# Altium schematic sheet esquematicobluepill.SchDoc (part 2 of 3)
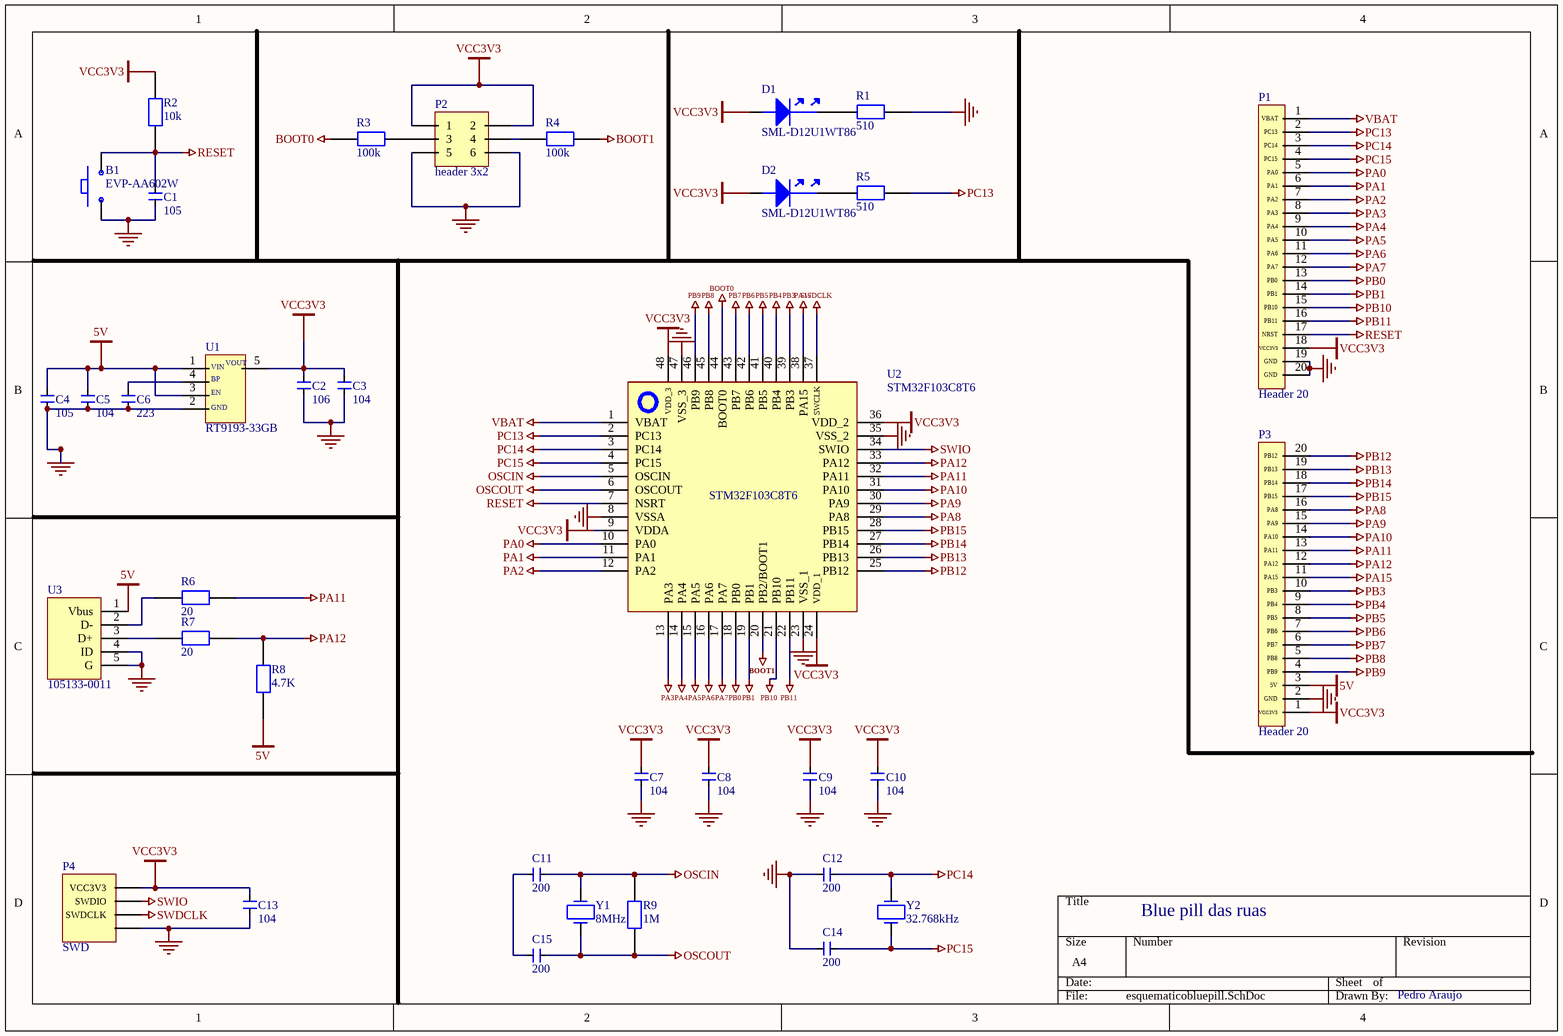
[diagram p1: esquematicobluepill.SchDoc]
## Library data of the parts
B1 = EVP-AA602W: Switch Tactile N.O. SPST Rectangular Button J-Bend 0.02A 15VDC 3.5N SMD Embossed T/R; Manufacturer: Panasonic; Actuator Length: 300µm; Contact Current Rating: 20mA; Contact Resistance: 100mΩ; Current Rating: 50mA; Electrical Life: 200kcycles; Illumination Type: Illuminated, Non-Illuminated; Max Voltage Rating (DC): 15V; Number of Positions: 1; Switch Function: Off-Mom; Switch Travel: 150µm; Supplier: DigiKey; Supplier Part Number: 10-EVP-AA602WCT-ND; Manufacturer Part Number: EVP-AA602W; RoHS: Compliant; Category: Tactile Switches; Stock: 14605; Pricing: 1=0,83, 10=0,713, 25=0,6632, 100=0,5917, 250=0,54812, 500=0,51772, 1000=0,48978, 2500=0,45678 (USD); Case/Package: SMD/SMT; Color: White; Contact Plating: Gold, Silver; Depth: 2.9mm; Height: 1.4mm; Insulation Resistance: 100MΩ; Lead Free: Lead Free; Length: 4.3mm; Lifecycle Status: Production; Max Current Rating: 20mA; Max Operating Temperature: 85°C; Mechanical Life: 200kcycles; Min Operating Temperature: -40°C; Mounting Technology: Surface Mount; Operating Force: 3.5N; Radiation Hardening: No; REACH SVHC: Yes; Termination: J-Bend; Throw Configuration: SPST; Voltage Rating (DC): 15V; ComponentLink1URL: https://datasheet.octopart.com:443/EVPAA602W-Panasonic-datasheet-156880147.pdf?src-supplier=IHS; ComponentLink1Description: https://datasheet.octopart.com:443/EVPAA602W-Panasonic-datasheet-156880147.pdf?src-supplier=IHS; ComponentLink2URL: https://datasheet.octopart.com:443/EVP-AA602W-Panasonic-datasheet-13050113.pdf?src-supplier=element14+APAC; ComponentLink2Description: https://datasheet.octopart.com:443/EVP-AA602W-Panasonic-datasheet-13050113.pdf?src-supplier=element14+APAC; ComponentLink3URL: https://datasheet.octopart.com:443/EVP-AA602W-Panasonic-datasheet-138897654.pdf?src-supplier=Master+Electronics; ComponentLink3Description: https://datasheet.octopart.com:443/EVP-AA602W-Panasonic-datasheet-138897654.pdf?src-supplier=Master+Electronics; ComponentLink4URL: https://datasheet.octopart.com:443/EVPAA602W-Panasonic-datasheet-130260647.pdf?src-supplier=TME; ComponentLink4Description: https://datasheet.octopart.com:443/EVPAA602W-Panasonic-datasheet-130260647.pdf?src-supplier=TME; ComponentLink5URL: https://datasheet.octopart.com:443/EVP-AA602W-Panasonic-datasheet-94103455.pdf?src-supplier=Future+Electronics; ComponentLink5Description: https://datasheet.octopart.com:443/EVP-AA602W-Panasonic-datasheet-94103455.pdf?src-supplier=Future+Electronics; ComponentLink6URL: https://datasheet.octopart.com:443/EVP-AA602W-Panasonic-datasheet-84052654.pdf?src-supplier=Future+Electronics; ComponentLink6Description: https://datasheet.octopart.com:443/EVP-AA602W-Panasonic-datasheet-84052654.pdf?src-supplier=Future+Electronics; ComponentLink7URL: https://datasheet.octopart.com:443/EVP-AA602W-Panasonic-datasheet-62282203.pdf?src-supplier=Electro+Sonic; ComponentLink7Description: https://datasheet.octopart.com:443/EVP-AA602W-Panasonic-datasheet-62282203.pdf?src-supplier=Electro+Sonic; ComponentLink8URL: https://datasheet.octopart.com:443/EVPAA602W-Panasonic-datasheet-10854221.pdf?src-supplier=Farnell; ComponentLink8Description: https://datasheet.octopart.com:443/EVPAA602W-Panasonic-datasheet-10854221.pdf?src-supplier=Farnell; ComponentLink9URL: https://datasheet.octopart.com:443/EVP-AA602W-Panasonic-datasheet-124616.pdf?src-supplier=DigiKey; ComponentLink9Description: https://datasheet.octopart.com:443/EVP-AA602W-Panasonic-datasheet-124616.pdf?src-supplier=DigiKey
C1 C4 = CL10B105KP8NNNC: 10V 1uF X7R ±10% 0603 Multilayer Ceramic Capacitors MLCC - SMD/SMT ROHS; Manufacturer: Samsung Electro-Mechanics; Value: 1µF; Supplier: DigiKey; Supplier Part Number: 1276-1946-1-ND; Manufacturer Part Number: CL10B105KP8NNNC; RoHS: Compliant; Category: Ceramic Capacitors; Stock: 4586205; Pricing: 1=0,08, 10=0,005 (USD); Case/Package: 0603; Case Code (Imperial): 0603; Case Code (Metric): 1608; China RoHS: Compliant; Contact Plating: Tin; Depth: 800µm; Dielectric: X7R; Dielectric Material: Ceramic; Height: 900µm; Lead Free: Lead Free; Length: 1.6mm; Lifecycle Status: Production; Material: Ceramic; Max Operating Temperature: 125°C; Min Operating Temperature: -55°C; Mounting Technology: Surface Mount; Number of Terminals: 2; Radiation Hardening: No; REACH SVHC: Yes; Schedule B: 8532240020, 8532240020|8532240020, 8532240020|8532240020|8532240020, 8532240020|8532240020|8532240020|8532240020; Thickness: 889µm; Tolerance: 10%; Voltage Rating: 10V; Voltage Rating (DC): 10V; Width: 800µm; ComponentLink1URL: https://datasheet.octopart.com:443/CL10B105KP8NNNC-Samsung-Electro-Mechanics-datasheet-136482318.pdf?src-supplier=IHS; ComponentLink1Description: https://datasheet.octopart.com:443/CL10B105KP8NNNC-Samsung-Electro-Mechanics-datasheet-136482318.pdf?src-supplier=IHS; ComponentLink2URL: https://datasheet.octopart.com:443/CL10B105KP8NNNC-Samsung-Electro-Mechanics-datasheet-116051279.pdf?src-supplier=Future+Electronics; ComponentLink2Description: https://datasheet.octopart.com:443/CL10B105KP8NNNC-Samsung-Electro-Mechanics-datasheet-116051279.pdf?src-supplier=Future+Electronics; ComponentLink3URL: https://datasheet.octopart.com:443/CL10B105KP8NNNC-Samsung-Electro-Mechanics-datasheet-81461854.pdf?src-supplier=Future+Electronics; ComponentLink3Description: https://datasheet.octopart.com:443/CL10B105KP8NNNC-Samsung-Electro-Mechanics-datasheet-81461854.pdf?src-supplier=Future+Electronics; ComponentLink4URL: https://datasheet.octopart.com:443/CL10B105KP8NNNC-Samsung-datasheet-13325309.pdf?src-supplier=Future+Electronics; ComponentLink4Description: https://datasheet.octopart.com:443/CL10B105KP8NNNC-Samsung-datasheet-13325309.pdf?src-supplier=Future+Electronics; ComponentLink5URL: https://datasheet.octopart.com:443/CL10B105KP8NNNC-Samsung-datasheet-26669024.pdf?src-supplier=Future+Electronics; ComponentLink5Description: https://datasheet.octopart.com:443/CL10B105KP8NNNC-Samsung-datasheet-26669024.pdf?src-supplier=Future+Electronics; ComponentLink6URL: https://datasheet.octopart.com:443/CL10B105KP8NNNC-Samsung-Electro-Mechanics-datasheet-149136800.pdf?src-supplier=Future+Electronics; ComponentLink6Description: https://datasheet.octopart.com:443/CL10B105KP8NNNC-Samsung-Electro-Mechanics-datasheet-149136800.pdf?src-supplier=Future+Electronics; ComponentLink7URL: https://datasheet.octopart.com:443/CL10B105KP8NNNC-Samsung-datasheet-37081328.pdf?src-supplier=Future+Electronics; ComponentLink7Description: https://datasheet.octopart.com:443/CL10B105KP8NNNC-Samsung-datasheet-37081328.pdf?src-supplier=Future+Electronics; ComponentLink8URL: https://datasheet.octopart.com/CL10B105KP8NNNC-Samsung-Electro-Mechanics-datasheet-97040617.pdf; ComponentLink8Description: https://datasheet.octopart.com/CL10B105KP8NNNC-Samsung-Electro-Mechanics-datasheet-97040617.pdf; ComponentLink9URL: https://datasheet.octopart.com/CL10B105KP8NNNC-Samsung-Electro-Mechanics-datasheet-8324245.pdf; ComponentLink9Description: https://datasheet.octopart.com/CL10B105KP8NNNC-Samsung-Electro-Mechanics-datasheet-8324245.pdf; ComponentLink10URL: https://datasheet.octopart.com/General-Multilayer-Ceramic-Capacitors-Samsung-datasheet-family-111.pdf; ComponentLink10Description: https://datasheet.octopart.com/General-Multilayer-Ceramic-Capacitors-Samsung-datasheet-family-111.pdf; ComponentLink11URL: https://datasheet.octopart.com:443/CL10B105KP8NNNC-Samsung-Electro-Mechanics-datasheet-11881110.pdf?src-supplier=Arrow+Electronics; ComponentLink11Description: https://datasheet.octopart.com:443/CL10B105KP8NNNC-Samsung-Electro-Mechanics-datasheet-11881110.pdf?src-supplier=Arrow+Electronics; ComponentLink12URL: https://datasheet.octopart.com:443/CL10B105KP8NNNC-Samsung-datasheet-59220082.pdf?src-supplier=TME; ComponentLink12Description: https://datasheet.octopart.com:443/CL10B105KP8NNNC-Samsung-datasheet-59220082.pdf?src-supplier=TME; ComponentLink13URL: http://sigma.octopart.com:80/rohs_certificate/General-Multilayer-Ceramic-Capacitors-Samsung-family-110.pdf?src-supplier=Compliance+Statements; ComponentLink13Description: http://sigma.octopart.com:80/rohs_certificate/General-Multilayer-Ceramic-Capacitors-Samsung-family-110.pdf?src-supplier=Compliance+Statements; ComponentLink14URL: http://sigma.octopart.com:80/rohs_statement/General-Multilayer-Ceramic-Capacitors-Samsung-family-132.pdf?src-supplier=Compliance+Statements; ComponentLink14Description: http://sigma.octopart.com:80/rohs_statement/General-Multilayer-Ceramic-Capacitors-Samsung-family-132.pdf?src-supplier=Compliance+Statements; ComponentLink15URL: http://sigma.octopart.com:80/reach_statement/General-Multilayer-Ceramic-Capacitors-Samsung-family-133.pdf?src-supplier=Compliance+Statements; ComponentLink15Description: http://sigma.octopart.com:80/reach_statement/General-Multilayer-Ceramic-Capacitors-Samsung-family-133.pdf?src-supplier=Compliance+Statements
C2 = CL10A106KP8NNNC: 10V 10uF X5R ±10% 0603 Multilayer Ceramic Capacitors MLCC - SMD/SMT ROHS; Manufacturer: Samsung Electro-Mechanics; Value: 10µF; Supplier: DigiKey; Supplier Part Number: 1276-1192-1-ND; Manufacturer Part Number: CL10A106KP8NNNC; RoHS: Compliant; Category: Ceramic Capacitors; Stock: 27744; Pricing: 1=0,08, 10=0,023 (USD); Case/Package: 0603; Case Code (Imperial): 0603; Case Code (Metric): 1608; China RoHS: Compliant; Contact Plating: Tin; Depth: 800µm; Dielectric: X5R; Dielectric Material: Ceramic; Height: 800µm; Lead Free: Lead Free; Length: 1.6mm; Lifecycle Status: Production; Material: Ceramic; Max Operating Temperature: 85°C; Min Operating Temperature: -55°C; Mounting Technology: Surface Mount; Number of Terminals: 2; Radiation Hardening: No; REACH SVHC: Yes; Schedule B: 8532240020, 8532240020|8532240020|8532240020|8532240020|8532240020|8532240020|8532240020|8532240020|8532240020|8532240020|8532240020|8532240020|8532240020|8532240020|8532240020|8532240020|8532240020|8532240020|8532240020|8532240020|8532240020|8532240020|8532240020|85; Thickness: 889µm; Tolerance: 10%; Voltage Rating: 10V; Voltage Rating (DC): 10V; Width: 800µm; ComponentLink1URL: https://datasheet.octopart.com:443/CL10A106KP8NNNC-Samsung-Electro-Mechanics-datasheet-181960519.pdf?src-supplier=IHS; ComponentLink1Description: https://datasheet.octopart.com:443/CL10A106KP8NNNC-Samsung-Electro-Mechanics-datasheet-181960519.pdf?src-supplier=IHS; ComponentLink2URL: https://datasheet.octopart.com/CL10A106KP8NNNC-Samsung-Electro-Mechanics-datasheet-8324245.pdf; ComponentLink2Description: https://datasheet.octopart.com/CL10A106KP8NNNC-Samsung-Electro-Mechanics-datasheet-8324245.pdf; ComponentLink3URL: https://datasheet.octopart.com/CL10A106KP8NNNC-Samsung-Electro-Mechanics-datasheet-97040617.pdf; ComponentLink3Description: https://datasheet.octopart.com/CL10A106KP8NNNC-Samsung-Electro-Mechanics-datasheet-97040617.pdf; ComponentLink4URL: https://datasheet.octopart.com/General-Multilayer-Ceramic-Capacitors-Samsung-datasheet-family-111.pdf; ComponentLink4Description: https://datasheet.octopart.com/General-Multilayer-Ceramic-Capacitors-Samsung-datasheet-family-111.pdf; ComponentLink5URL: https://datasheet.octopart.com:443/CL10A106KP8NNNC-Samsung-Electro-Mechanics-datasheet-136031754.pdf?src-supplier=Future+Electronics; ComponentLink5Description: https://datasheet.octopart.com:443/CL10A106KP8NNNC-Samsung-Electro-Mechanics-datasheet-136031754.pdf?src-supplier=Future+Electronics; ComponentLink6URL: https://datasheet.octopart.com:443/CL10A106KP8NNNC-Samsung-Electro-Mechanics-datasheet-110226289.pdf?src-supplier=Future+Electronics; ComponentLink6Description: https://datasheet.octopart.com:443/CL10A106KP8NNNC-Samsung-Electro-Mechanics-datasheet-110226289.pdf?src-supplier=Future+Electronics; ComponentLink7URL: https://datasheet.octopart.com:443/CL10A106KP8NNNC-Samsung-Electro-Mechanics-datasheet-81461787.pdf?src-supplier=Future+Electronics; ComponentLink7Description: https://datasheet.octopart.com:443/CL10A106KP8NNNC-Samsung-Electro-Mechanics-datasheet-81461787.pdf?src-supplier=Future+Electronics; ComponentLink8URL: https://datasheet.octopart.com:443/CL10A106KP8NNNC-Samsung-datasheet-48647232.pdf?src-supplier=Future+Electronics; ComponentLink8Description: https://datasheet.octopart.com:443/CL10A106KP8NNNC-Samsung-datasheet-48647232.pdf?src-supplier=Future+Electronics; ComponentLink9URL: https://datasheet.octopart.com:443/CL10A106KP8NNNC-Samsung-datasheet-34157262.pdf?src-supplier=Future+Electronics; ComponentLink9Description: https://datasheet.octopart.com:443/CL10A106KP8NNNC-Samsung-datasheet-34157262.pdf?src-supplier=Future+Electronics; ComponentLink10URL: https://datasheet.octopart.com:443/CL10A106KP8NNNC-Samsung-datasheet-26589120.pdf?src-supplier=Future+Electronics; ComponentLink10Description: https://datasheet.octopart.com:443/CL10A106KP8NNNC-Samsung-datasheet-26589120.pdf?src-supplier=Future+Electronics; ComponentLink11URL: https://datasheet.octopart.com:443/CL10A106KP8NNNC-Samsung-Electro-Mechanics-datasheet-149156481.pdf?src-supplier=Future+Electronics; ComponentLink11Description: https://datasheet.octopart.com:443/CL10A106KP8NNNC-Samsung-Electro-Mechanics-datasheet-149156481.pdf?src-supplier=Future+Electronics; ComponentLink12URL: https://datasheet.octopart.com:443/CL10A106KP8NNNC-Samsung-Electro-Mechanics-datasheet-11968064.pdf?src-supplier=Arrow+Electronics; ComponentLink12Description: https://datasheet.octopart.com:443/CL10A106KP8NNNC-Samsung-Electro-Mechanics-datasheet-11968064.pdf?src-supplier=Arrow+Electronics; ComponentLink13URL: https://datasheet.octopart.com:443/CL10A106KP8NNNC-Samsung-datasheet-8326407.pdf?src-supplier=TME; ComponentLink13Description: https://datasheet.octopart.com:443/CL10A106KP8NNNC-Samsung-datasheet-8326407.pdf?src-supplier=TME; ComponentLink14URL: http://sigma.octopart.com:80/rohs_certificate/General-Multilayer-Ceramic-Capacitors-Samsung-family-110.pdf?src-supplier=Compliance+Statements; ComponentLink14Description: http://sigma.octopart.com:80/rohs_certificate/General-Multilayer-Ceramic-Capacitors-Samsung-family-110.pdf?src-supplier=Compliance+Statements; ComponentLink15URL: http://sigma.octopart.com:80/rohs_statement/General-Multilayer-Ceramic-Capacitors-Samsung-family-132.pdf?src-supplier=Compliance+Statements; ComponentLink15Description: http://sigma.octopart.com:80/rohs_statement/General-Multilayer-Ceramic-Capacitors-Samsung-family-132.pdf?src-supplier=Compliance+Statements; ComponentLink16URL: http://sigma.octopart.com:80/reach_statement/General-Multilayer-Ceramic-Capacitors-Samsung-family-133.pdf?src-supplier=Compliance+Statements; ComponentLink16Description: http://sigma.octopart.com:80/reach_statement/General-Multilayer-Ceramic-Capacitors-Samsung-family-133.pdf?src-supplier=Compliance+Statements
C3 C5 C7-C10 C13 = CL03A104KP3NNNC: 10V 100nF X5R ±10% 0201 Multilayer Ceramic Capacitors MLCC - SMD/SMT ROHS; Manufacturer: Samsung Electro-Mechanics; Supplier: DigiKey; Supplier Part Number: 1276-1115-1-ND; Manufacturer Part Number: CL03A104KP3NNNC; RoHS: Compliant; Category: Ceramic Capacitors; Stock: 51; Pricing: 1=0,08, 10=0,003 (USD); Value: 100nF; Case/Package: 0201; Case Code (Imperial): 0201; Case Code (Metric): 0603; China RoHS: Compliant; Contact Plating: Tin; Depth: 300µm; Dielectric: X5R; Dielectric Material: Ceramic; Height: 300µm; Lead Free: Lead Free; Length: 600µm; Lifecycle Status: Production; Material: Ceramic; Max Operating Temperature: 85°C; Min Operating Temperature: -55°C; Mounting Technology: Surface Mount; Number of Terminals: 2; Packaging: Tape & Reel; Radiation Hardening: No; REACH SVHC: Yes; Schedule B: 8532240020, 8532240020|8532240020, 8532240020|8532240020|8532240020, 8532240020|8532240020|8532240020|8532240020; Thickness: 330.2µm; Tolerance: 10%; Voltage Rating: 10V; Voltage Rating (DC): 10V; Width: 300µm; ComponentLink1URL: https://datasheet.octopart.com:443/CL03A104KP3NNNC-Samsung-Electro-Mechanics-datasheet-136031699.pdf?src-supplier=IHS; ComponentLink1Description: https://datasheet.octopart.com:443/CL03A104KP3NNNC-Samsung-Electro-Mechanics-datasheet-136031699.pdf?src-supplier=IHS; ComponentLink2URL: https://datasheet.octopart.com:443/CL03A104KP3NNNC-Samsung-Electro-Mechanics-datasheet-141346650.pdf?src-supplier=Samsung+SCT; ComponentLink2Description: https://datasheet.octopart.com:443/CL03A104KP3NNNC-Samsung-Electro-Mechanics-datasheet-141346650.pdf?src-supplier=Samsung+SCT; ComponentLink3URL: https://datasheet.octopart.com:443/CL03A104KP3NNNC-Samsung-Electro-Mechanics-datasheet-110226168.pdf?src-supplier=Future+Electronics; ComponentLink3Description: https://datasheet.octopart.com:443/CL03A104KP3NNNC-Samsung-Electro-Mechanics-datasheet-110226168.pdf?src-supplier=Future+Electronics; ComponentLink4URL: https://datasheet.octopart.com:443/CL03A104KP3NNNC-Samsung-Electro-Mechanics-datasheet-96443584.pdf?src-supplier=Future+Electronics; ComponentLink4Description: https://datasheet.octopart.com:443/CL03A104KP3NNNC-Samsung-Electro-Mechanics-datasheet-96443584.pdf?src-supplier=Future+Electronics; ComponentLink5URL: https://datasheet.octopart.com:443/CL03A104KP3NNNC-Samsung-Electro-Mechanics-datasheet-68297032.pdf?src-supplier=Future+Electronics; ComponentLink5Description: https://datasheet.octopart.com:443/CL03A104KP3NNNC-Samsung-Electro-Mechanics-datasheet-68297032.pdf?src-supplier=Future+Electronics; ComponentLink6URL: https://datasheet.octopart.com:443/CL03A104KP3NNNC-Samsung-datasheet-42485101.pdf?src-supplier=Future+Electronics; ComponentLink6Description: https://datasheet.octopart.com:443/CL03A104KP3NNNC-Samsung-datasheet-42485101.pdf?src-supplier=Future+Electronics; ComponentLink7URL: https://datasheet.octopart.com:443/CL03A104KP3NNNC-Samsung-datasheet-28508247.pdf?src-supplier=Future+Electronics; ComponentLink7Description: https://datasheet.octopart.com:443/CL03A104KP3NNNC-Samsung-datasheet-28508247.pdf?src-supplier=Future+Electronics; ComponentLink8URL: https://datasheet.octopart.com:443/CL03A104KP3NNNC-Samsung-datasheet-8325397.pdf?src-supplier=Future+Electronics; ComponentLink8Description: https://datasheet.octopart.com:443/CL03A104KP3NNNC-Samsung-datasheet-8325397.pdf?src-supplier=Future+Electronics; ComponentLink9URL: https://datasheet.octopart.com:443/CL03A104KP3NNNC-Samsung-Electro-Mechanics-datasheet-149136603.pdf?src-supplier=Future+Electronics; ComponentLink9Description: https://datasheet.octopart.com:443/CL03A104KP3NNNC-Samsung-Electro-Mechanics-datasheet-149136603.pdf?src-supplier=Future+Electronics; ComponentLink10URL: https://datasheet.octopart.com/CL03A104KP3NNNC-Samsung-Electro-Mechanics-datasheet-97040617.pdf; ComponentLink10Description: https://datasheet.octopart.com/CL03A104KP3NNNC-Samsung-Electro-Mechanics-datasheet-97040617.pdf; ComponentLink11URL: https://datasheet.octopart.com/CL03A104KP3NNNC-Samsung-Electro-Mechanics-datasheet-8324245.pdf; ComponentLink11Description: https://datasheet.octopart.com/CL03A104KP3NNNC-Samsung-Electro-Mechanics-datasheet-8324245.pdf; ComponentLink12URL: https://datasheet.octopart.com/General-Multilayer-Ceramic-Capacitors-Samsung-datasheet-family-111.pdf; ComponentLink12Description: https://datasheet.octopart.com/General-Multilayer-Ceramic-Capacitors-Samsung-datasheet-family-111.pdf; ComponentLink13URL: https://datasheet.octopart.com:443/CL03A104KP3NNNC-Samsung-datasheet-8326407.pdf?src-supplier=TME; ComponentLink13Description: https://datasheet.octopart.com:443/CL03A104KP3NNNC-Samsung-datasheet-8326407.pdf?src-supplier=TME; ComponentLink14URL: https://datasheet.octopart.com:443/CL03A104KP3NNNC-Samsung-Electro-Mechanics-datasheet-11541288.pdf?src-supplier=Arrow+Electronics; ComponentLink14Description: https://datasheet.octopart.com:443/CL03A104KP3NNNC-Samsung-Electro-Mechanics-datasheet-11541288.pdf?src-supplier=Arrow+Electronics; ComponentLink15URL: http://sigma.octopart.com:80/rohs_certificate/General-Multilayer-Ceramic-Capacitors-Samsung-family-110.pdf?src-supplier=Compliance+Statements; ComponentLink15Description: http://sigma.octopart.com:80/rohs_certificate/General-Multilayer-Ceramic-Capacitors-Samsung-family-110.pdf?src-supplier=Compliance+Statements; ComponentLink16URL: http://sigma.octopart.com:80/rohs_statement/General-Multilayer-Ceramic-Capacitors-Samsung-family-132.pdf?src-supplier=Compliance+Statements; ComponentLink16Description: http://sigma.octopart.com:80/rohs_statement/General-Multilayer-Ceramic-Capacitors-Samsung-family-132.pdf?src-supplier=Compliance+Statements; ComponentLink17URL: http://sigma.octopart.com:80/reach_statement/General-Multilayer-Ceramic-Capacitors-Samsung-family-133.pdf?src-supplier=Compliance+Statements; ComponentLink17Description: http://sigma.octopart.com:80/reach_statement/General-Multilayer-Ceramic-Capacitors-Samsung-family-133.pdf?src-supplier=Compliance+Statements
C6 = CL03A223KP3NNNC: Multilayer Ceramic Capacitor, 0.022 uF, 10 V, ± 10%, X5R, 0201 [0603 Metric]; Manufacturer: Samsung Electro-Mechanics; Value: 22nF; Voltage Rating: 10V; Supplier: DigiKey; Supplier Part Number: 1276-1329-1-ND; Manufacturer Part Number: CL03A223KP3NNNC; RoHS: Compliant; Category: Ceramic Capacitors; Stock: 118; Pricing: 1=0,1, 10=0,027, 50=0,018, 100=0,0153 (USD); Case/Package: 0201; Case Code (Imperial): 0201; Case Code (Metric): 0603; China RoHS: Compliant; Dielectric: X5R; Dielectric Material: Ceramic; Height: 330µm; Length: 609.6µm; Lifecycle Status: Obsolete; Material: Ceramic; Max Operating Temperature: 85°C; Min Operating Temperature: -55°C; Mounting Technology: Surface Mount; Number of Terminals: 2; Packaging: Tape & Reel (TR); REACH SVHC: Yes; Thickness: 330.2µm; Tolerance: 10%; Voltage Rating (DC): 10V; Width: 304.8µm; ComponentLink1URL: https://datasheet.octopart.com:443/CL03A223KP3NNNC-Samsung-Electro-Mechanics-datasheet-136322589.pdf?src-supplier=IHS; ComponentLink1Description: https://datasheet.octopart.com:443/CL03A223KP3NNNC-Samsung-Electro-Mechanics-datasheet-136322589.pdf?src-supplier=IHS; ComponentLink2URL: https://datasheet.octopart.com:443/CL03A223KP3NNNC-Samsung-Electro-Mechanics-datasheet-108317490.pdf?src-supplier=Future+Electronics; ComponentLink2Description: https://datasheet.octopart.com:443/CL03A223KP3NNNC-Samsung-Electro-Mechanics-datasheet-108317490.pdf?src-supplier=Future+Electronics; ComponentLink3URL: https://datasheet.octopart.com:443/CL03A223KP3NNNC-Samsung-Electro-Mechanics-datasheet-158434187.pdf?src-supplier=Future+Electronics; ComponentLink3Description: https://datasheet.octopart.com:443/CL03A223KP3NNNC-Samsung-Electro-Mechanics-datasheet-158434187.pdf?src-supplier=Future+Electronics; ComponentLink4URL: https://datasheet.octopart.com/CL03A223KP3NNNC-Samsung-Electro-Mechanics-datasheet-97040617.pdf; ComponentLink4Description: https://datasheet.octopart.com/CL03A223KP3NNNC-Samsung-Electro-Mechanics-datasheet-97040617.pdf; ComponentLink5URL: https://datasheet.octopart.com/CL03A223KP3NNNC-Samsung-Electro-Mechanics-datasheet-8324245.pdf; ComponentLink5Description: https://datasheet.octopart.com/CL03A223KP3NNNC-Samsung-Electro-Mechanics-datasheet-8324245.pdf
C11 C12 C14 C15 = CL10C200JB81PNC: Cap Ceramic 20pF 50V C0G 5% Pad SMD 0603 125C Automotive T/R; Manufacturer: Samsung Electro-Mechanics; Temperature Coefficient: 30ppm/°C; Supplier: DigiKey; Supplier Part Number: 1276-2219-1-ND; Manufacturer Part Number: CL10C200JB81PNC; RoHS: Compliant; Category: Ceramic Capacitors; Stock: 9831; Pricing: 1=0,12, 10=0,066, 50=0,043, 100=0,035, 500=0,02542, 1000=0,02212 (USD); Value: 20pF; Case/Package: 0603; Case Code (Imperial): 0603; Case Code (Metric): 1608; China RoHS: Compliant; Depth: 800µm; Dielectric: C0G; Dielectric Material: Ceramic; Height: 900µm; Length: 1.6002mm; Lifecycle Status: Production; Material: Ceramic; Max Operating Temperature: 125°C; Min Operating Temperature: -55°C; Mounting Technology: Surface Mount; Number of Terminals: 2; Packaging: Tape & Reel (TR); Ratings: AEC-Q200; REACH SVHC: Yes; Thickness: 889µm; Tolerance: 5%; Voltage Rating: 50V; Voltage Rating (DC): 50V; Width: 787.4µm; ComponentLink1URL: https://datasheet.octopart.com:443/CL10C200JB81PNC-Samsung-Electro-Mechanics-datasheet-176142735.pdf?src-supplier=IHS; ComponentLink1Description: https://datasheet.octopart.com:443/CL10C200JB81PNC-Samsung-Electro-Mechanics-datasheet-176142735.pdf?src-supplier=IHS; ComponentLink2URL: https://datasheet.octopart.com:443/CL10C200JB81PNC-Samsung-Electro-Mechanics-datasheet-141347356.pdf?src-supplier=Samsung+SCT; ComponentLink2Description: https://datasheet.octopart.com:443/CL10C200JB81PNC-Samsung-Electro-Mechanics-datasheet-141347356.pdf?src-supplier=Samsung+SCT; ComponentLink3URL: https://datasheet.octopart.com:443/CL10C200JB81PNC-Samsung-Electro-Mechanics-datasheet-11972684.pdf?src-supplier=Arrow+Electronics; ComponentLink3Description: https://datasheet.octopart.com:443/CL10C200JB81PNC-Samsung-Electro-Mechanics-datasheet-11972684.pdf?src-supplier=Arrow+Electronics
D1 D2 = SML-D12U1WT86: LED Uni-Color Red 2-Pin Chip 0603(1608Metric) T/R; Manufacturer: ROHM; Dominant Wavelength: 620nm; Forward Current: 20mA; Forward Voltage: 2.2V; Lens Color: White; Lens Transparency: Diffused; Luminous Flux: 1Zlm; Luminous Intensity: 63mcd; Number of Circuits: 1; Power Dissipation: 54mW; Reverse Voltage: 5V; Shape: Rectangular; Supplier: DigiKey; Supplier Part Number: SML-D12U1WT86CT-ND; Manufacturer Part Number: SML-D12U1WT86; RoHS: Compliant; Category: LEDs; Stock: 91539; Pricing: 1=0,12, 10=0,081, 100=0,0556, 500=0,0438, 1000=0,03986 (USD); Case/Package: 1608; Case Code (Imperial): 0603; Case Code (Metric): 1608; Color: Red; Height: 550µm; Lead Free: Lead Free; Length: 1.6mm; Lifecycle Status: Production; Max Operating Temperature: 85°C; Min Operating Temperature: -40°C; Mounting Technology: Surface Mount; Number of Terminals: 2; REACH SVHC: Yes; Terminal Pitch: 1.65mm; Test Current: 20mA; Wavelength: 620nm; Width: 800µm; ComponentLink1URL: https://datasheet.octopart.com:443/SML-D12U1WT86-ROHM-datasheet-175953608.pdf?src-supplier=Future+Electronics; ComponentLink1Description: https://datasheet.octopart.com:443/SML-D12U1WT86-ROHM-datasheet-175953608.pdf?src-supplier=Future+Electronics; ComponentLink2URL: https://datasheet.octopart.com:443/SML-D12U1WT86-Rohm-datasheet-68298509.pdf?src-supplier=Future+Electronics; ComponentLink2Description: https://datasheet.octopart.com:443/SML-D12U1WT86-Rohm-datasheet-68298509.pdf?src-supplier=Future+Electronics; ComponentLink3URL: https://datasheet.octopart.com:443/SML-D12U1WT86-Rohm-datasheet-62059860.pdf?src-supplier=Future+Electronics; ComponentLink3Description: https://datasheet.octopart.com:443/SML-D12U1WT86-Rohm-datasheet-62059860.pdf?src-supplier=Future+Electronics; ComponentLink4URL: https://datasheet.octopart.com:443/SML-D12U1WT86-Rohm-datasheet-138791993.pdf?src-supplier=Upverter; ComponentLink4Description: https://datasheet.octopart.com:443/SML-D12U1WT86-Rohm-datasheet-138791993.pdf?src-supplier=Upverter; ComponentLink5URL: https://datasheet.octopart.com:443/SML-D12U1WT86-ROHM-datasheet-142144710.pdf?src-supplier=TME; ComponentLink5Description: https://datasheet.octopart.com:443/SML-D12U1WT86-ROHM-datasheet-142144710.pdf?src-supplier=TME; ComponentLink6URL: https://datasheet.octopart.com:443/SML-D12U1WT86-Rohm-datasheet-142144708.pdf?src-supplier=Rohm+SCT; ComponentLink6Description: https://datasheet.octopart.com:443/SML-D12U1WT86-Rohm-datasheet-142144708.pdf?src-supplier=Rohm+SCT
P1 = 22-28-4200 p3: KK 254 Breakaway Header, Vertical, 20 Circuits, Tin (Sn) Plating, Mating Pin Length 6.09mm; Manufacturer: Molex; Manufacturer Lifecycle Status: ACTIVE; Connector Type: Male Pin; Contact Resistance: 10mΩ; Current Rating: 4A; Gender: Male; Insulation Resistance: 1GΩ; Max Voltage Rating (AC): 250V; Number of Circuits: 19; Number of Contacts: 20; Operating Force: 4.8928N; Pitch: 2.54mm; Plating Thickness: 2.54µm; Supplier: DigiKey; Supplier Part Number: WM50014-20-ND; Manufacturer Part Number: 22-28-4200; RoHS: Compliant; Category: Headers and Wire Housings; Stock: 376; Pricing: 1=0,96, 10=0,817, 100=0,6941, 500=0,61948, 1000=0,5899, 5000=0,52659, 10000=0,50148 (USD); China RoHS: Compliant; Color: Black; Contact Gender: Male; Contact Mating Length: 6.096mm; Contact Plating: Tin; Country of Origin: US; Depth: 2.49mm; Housing Color: Black; Lead Free: Lead Free; Lead Pitch: 2.54mm; Length: 50.8mm; Lifecycle Status: Production; Max Operating Temperature: 80°C; Min Operating Temperature: -40°C; Mounting Technology: Through Hole; Pins: 20; Number of Positions: 20; Number of Rows: 1; Orientation: Vertical; Packaging: Bulk; Plating: Tin; REACH SVHC: Yes; Terminal Pitch: 2.54mm; Termination: Solder; Voltage Rating (DC): 250V; ComponentLink1URL: https://datasheet.octopart.com:443/0022284200-Molex-datasheet-180714220.pdf?src-supplier=IHS; ComponentLink1Description: https://datasheet.octopart.com:443/0022284200-Molex-datasheet-180714220.pdf?src-supplier=IHS; ComponentLink2URL: https://datasheet.octopart.com:443/22-28-4200-Molex-datasheet-177722861.pdf?src-supplier=IHS; ComponentLink2Description: https://datasheet.octopart.com:443/22-28-4200-Molex-datasheet-177722861.pdf?src-supplier=IHS; ComponentLink3URL: https://datasheet.octopart.com:443/22-28-4200-Molex-datasheet-16300760.pdf?src-supplier=Molex; ComponentLink3Description: https://datasheet.octopart.com:443/22-28-4200-Molex-datasheet-16300760.pdf?src-supplier=Molex; ComponentLink4URL: https://sigma.octopart.com:443/16300370/technical_drawing/Molex-22-28-4200.pdf?src-supplier=Molex; ComponentLink4Description: https://sigma.octopart.com:443/16300370/technical_drawing/Molex-22-28-4200.pdf?src-supplier=Molex; ComponentLink5URL: https://datasheet.octopart.com:443/022284200-Molex-datasheet-8337137.pdf?src-supplier=Molex; ComponentLink5Description: https://datasheet.octopart.com:443/022284200-Molex-datasheet-8337137.pdf?src-supplier=Molex; ComponentLink6URL: https://datasheet.octopart.com:443/22-28-4200-Molex-datasheet-140181280.pdf?src-supplier=RS+(Formerly+Allied+Electronics); ComponentLink6Description: https://datasheet.octopart.com:443/22-28-4200-Molex-datasheet-140181280.pdf?src-supplier=RS+(Formerly+Allied+Electronics); ComponentLink7URL: https://datasheet.octopart.com:443/22-28-4200-Molex-datasheet-120146339.pdf?src-supplier=RS+(Formerly+Allied+Electronics); ComponentLink7Description: https://datasheet.octopart.com:443/22-28-4200-Molex-datasheet-120146339.pdf?src-supplier=RS+(Formerly+Allied+Electronics); ComponentLink8URL: https://datasheet.octopart.com:443/22-28-4200-Molex-datasheet-4210.pdf?src-supplier=DigiKey; ComponentLink8Description: https://datasheet.octopart.com:443/22-28-4200-Molex-datasheet-4210.pdf?src-supplier=DigiKey; ComponentLink9URL: http://sigma.octopart.com:80/16300761/rohs_statement/Molex-22-28-4200.pdf?src-supplier=Compliance+Statements; ComponentLink9Description: http://sigma.octopart.com:80/16300761/rohs_statement/Molex-22-28-4200.pdf?src-supplier=Compliance+Statements; ComponentLink10URL: http://sigma.octopart.com:80/conflict_mineral_statement/Molex-company-72.pdf?src-supplier=Compliance+Statements; ComponentLink10Description: http://sigma.octopart.com:80/conflict_mineral_statement/Molex-company-72.pdf?src-supplier=Compliance+Statements; ComponentLink11URL: http://sigma.octopart.com:80/rohs_statement/Molex-company-73.pdf?src-supplier=Compliance+Statements; ComponentLink11Description: http://sigma.octopart.com:80/rohs_statement/Molex-company-73.pdf?src-supplier=Compliance+Statements; ComponentLink12URL: http://sigma.octopart.com:80/reach_statement/Molex-company-74.pdf?src-supplier=Compliance+Statements; ComponentLink12Description: http://sigma.octopart.com:80/reach_statement/Molex-company-74.pdf?src-supplier=Compliance+Statements
P2 = 15-91-2060: Conn Unshrouded Header HDR 6 POS 2.54mm Solder ST Top Entry SMD C-Grid Bag; Manufacturer: Molex; Manufacturer Lifecycle Status: ACTIVE; Contact Resistance: 15mΩ; Current Rating: 3A; Gender: Male; Glow Wire Compliant: Non-compliant; Max Voltage Rating (DC): 250.25kV; Number of Circuits: 5; Number of Contacts: 6; Plating: Tin; Plating Thickness: 3.81µm; Row Spacing: 4.44mm; Voltage Rating: 250V; Supplier: DigiKey; Supplier Part Number: WM17449-ND; Manufacturer Part Number: 15-91-2060; RoHS: Compliant; Category: Headers and Wire Housings; Stock: 6382; Pricing: 1=0,64, 10=0,54, 100=0,4586, 500=0,40928, 1000=0,38974, 5000=0,3479, 10000=0,3313 (USD); China RoHS: Compliant; Contact Gender: Male; Contact Material: Brass; Contact Plating: Tin; Country of Origin: US; ELV: Compliant; Flammability Rating: UL94 V-0; Halogen Free: Low Halogen; Housing Color: Black; Housing Material: Thermoplastic; Lead Free: Lead Free; Lead Pitch: 2.54mm; Lifecycle Status: Production; Material: Bronze; Max Operating Temperature: 105°C; Min Operating Temperature: -40°C; Mounting Technology: Surface Mount; Pins: 6; Number of Positions: 6; Number of Rows: 1; Orientation: Right Angle, Vertical; Packaging: Bulk; Pitch: 2.54mm; Radiation Hardening: No; REACH SVHC: Yes; Schedule B: 8536694040, 8536694040|8536694040|8536694040|8536694040|8536694040; Terminal Pitch: 2.54mm; Termination: SMD/SMT; Voltage Rating (DC): 250V; ComponentLink1URL: https://datasheet.octopart.com:443/015-91-2060-Molex-datasheet-180714819.pdf?src-supplier=IHS; ComponentLink1Description: https://datasheet.octopart.com:443/015-91-2060-Molex-datasheet-180714819.pdf?src-supplier=IHS; ComponentLink2URL: https://datasheet.octopart.com:443/015912060-Molex-datasheet-8333535.pdf?src-supplier=Upverter; ComponentLink2Description: https://datasheet.octopart.com:443/015912060-Molex-datasheet-8333535.pdf?src-supplier=Upverter; ComponentLink3URL: https://datasheet.octopart.com:443/15-91-2060-Molex-datasheet-167255.pdf?src-supplier=Newark; ComponentLink3Description: https://datasheet.octopart.com:443/15-91-2060-Molex-datasheet-167255.pdf?src-supplier=Newark; ComponentLink4URL: https://datasheet.octopart.com:443/15-91-2060-Molex-datasheet-112140292.pdf?src-supplier=Newark; ComponentLink4Description: https://datasheet.octopart.com:443/15-91-2060-Molex-datasheet-112140292.pdf?src-supplier=Newark; ComponentLink5URL: https://datasheet.octopart.com:443/15-91-2060-Molex-datasheet-32867571.pdf?src-supplier=Newark; ComponentLink5Description: https://datasheet.octopart.com:443/15-91-2060-Molex-datasheet-32867571.pdf?src-supplier=Newark; ComponentLink6URL: https://datasheet.octopart.com:443/15-91-2060-Molex-datasheet-21205732.pdf?src-supplier=Newark; ComponentLink6Description: https://datasheet.octopart.com:443/15-91-2060-Molex-datasheet-21205732.pdf?src-supplier=Newark; ComponentLink7URL: https://datasheet.octopart.com:443/15-91-2060-Molex-datasheet-13784410.pdf?src-supplier=Molex; ComponentLink7Description: https://datasheet.octopart.com:443/15-91-2060-Molex-datasheet-13784410.pdf?src-supplier=Molex; ComponentLink8URL: https://sigma.octopart.com:443/11591496/technical_drawing/Molex-15-91-2060.pdf?src-supplier=Molex; ComponentLink8Description: https://sigma.octopart.com:443/11591496/technical_drawing/Molex-15-91-2060.pdf?src-supplier=Molex; ComponentLink9URL: https://datasheet.octopart.com:443/15-91-2060-Molex-datasheet-101580612.pdf?src-supplier=element14+APAC; ComponentLink9Description: https://datasheet.octopart.com:443/15-91-2060-Molex-datasheet-101580612.pdf?src-supplier=element14+APAC; ComponentLink10URL: https://datasheet.octopart.com:443/15-91-2060-Molex-datasheet-154743799.pdf?src-supplier=Master+Electronics; ComponentLink10Description: https://datasheet.octopart.com:443/15-91-2060-Molex-datasheet-154743799.pdf?src-supplier=Master+Electronics; ComponentLink11URL: https://datasheet.octopart.com:443/15-91-2060-Molex-datasheet-21826448.pdf?src-supplier=Electro+Sonic; ComponentLink11Description: https://datasheet.octopart.com:443/15-91-2060-Molex-datasheet-21826448.pdf?src-supplier=Electro+Sonic; ComponentLink12URL: https://datasheet.octopart.com:443/15-91-2060-Molex-datasheet-62103021.pdf?src-supplier=Electro+Sonic; ComponentLink12Description: https://datasheet.octopart.com:443/15-91-2060-Molex-datasheet-62103021.pdf?src-supplier=Electro+Sonic; ComponentLink13URL: https://datasheet.octopart.com:443/15-91-2060-Molex-datasheet-37168100.pdf?src-supplier=Electro+Sonic; ComponentLink13Description: https://datasheet.octopart.com:443/15-91-2060-Molex-datasheet-37168100.pdf?src-supplier=Electro+Sonic; ComponentLink14URL: https://datasheet.octopart.com:443/15-91-2060-Molex-datasheet-168215678.pdf?src-supplier=TME; ComponentLink14Description: https://datasheet.octopart.com:443/15-91-2060-Molex-datasheet-168215678.pdf?src-supplier=TME; ComponentLink15URL: https://datasheet.octopart.com:443/15-91-2060-Molex-datasheet-140177408.pdf?src-supplier=RS+(Formerly+Allied+Electronics); ComponentLink15Description: https://datasheet.octopart.com:443/15-91-2060-Molex-datasheet-140177408.pdf?src-supplier=RS+(Formerly+Allied+Electronics); ComponentLink16URL: https://datasheet.octopart.com:443/15-91-2060-Molex-datasheet-120139705.pdf?src-supplier=RS+(Formerly+Allied+Electronics); ComponentLink16Description: https://datasheet.octopart.com:443/15-91-2060-Molex-datasheet-120139705.pdf?src-supplier=RS+(Formerly+Allied+Electronics); ComponentLink17URL: https://datasheet.octopart.com:443/15-91-2060-Molex-datasheet-110750473.pdf?src-supplier=RS+(Formerly+Allied+Electronics); ComponentLink17Description: https://datasheet.octopart.com:443/15-91-2060-Molex-datasheet-110750473.pdf?src-supplier=RS+(Formerly+Allied+Electronics); ComponentLink18URL: https://datasheet.octopart.com:443/15-91-2060-Molex-datasheet-140628.pdf?src-supplier=DigiKey; ComponentLink18Description: https://datasheet.octopart.com:443/15-91-2060-Molex-datasheet-140628.pdf?src-supplier=DigiKey; ComponentLink19URL: http://sigma.octopart.com:80/15622377/rohs_certificate/Molex-15-91-2060.pdf?src-supplier=Compliance+Statements; ComponentLink19Description: http://sigma.octopart.com:80/15622377/rohs_certificate/Molex-15-91-2060.pdf?src-supplier=Compliance+Statements; ComponentLink20URL: http://sigma.octopart.com:80/conflict_mineral_statement/Molex-company-72.pdf?src-supplier=Compliance+Statements; ComponentLink20Description: http://sigma.octopart.com:80/conflict_mineral_statement/Molex-company-72.pdf?src-supplier=Compliance+Statements; ComponentLink21URL: http://sigma.octopart.com:80/rohs_statement/Molex-company-73.pdf?src-supplier=Compliance+Statements; ComponentLink21Description: http://sigma.octopart.com:80/rohs_statement/Molex-company-73.pdf?src-supplier=Compliance+Statements; ComponentLink22URL: http://sigma.octopart.com:80/reach_statement/Molex-company-74.pdf?src-supplier=Compliance+Statements; ComponentLink22Description: http://sigma.octopart.com:80/reach_statement/Molex-company-74.pdf?src-supplier=Compliance+Statements
P3 = 22-28-4200 p4: KK 254 Breakaway Header, Vertical, 20 Circuits, Tin (Sn) Plating, Mating Pin Length 6.09mm; Manufacturer: Molex; Manufacturer Lifecycle Status: ACTIVE; Connector Type: Male Pin; Contact Resistance: 10mΩ; Current Rating: 4A; Gender: Male; Insulation Resistance: 1GΩ; Max Voltage Rating (AC): 250V; Number of Circuits: 19; Number of Contacts: 20; Operating Force: 4.8928N; Pitch: 2.54mm; Plating Thickness: 2.54µm; Supplier: DigiKey; Supplier Part Number: WM50014-20-ND; Manufacturer Part Number: 22-28-4200; RoHS: Compliant; Category: Headers and Wire Housings; Stock: 376; Pricing: 1=0,96, 10=0,817, 100=0,6941, 500=0,61948, 1000=0,5899, 5000=0,52659, 10000=0,50148 (USD); China RoHS: Compliant; Color: Black; Contact Gender: Male; Contact Mating Length: 6.096mm; Contact Plating: Tin; Country of Origin: US; Depth: 2.49mm; Housing Color: Black; Lead Free: Lead Free; Lead Pitch: 2.54mm; Length: 50.8mm; Lifecycle Status: Production; Max Operating Temperature: 80°C; Min Operating Temperature: -40°C; Mounting Technology: Through Hole; Pins: 20; Number of Positions: 20; Number of Rows: 1; Orientation: Vertical; Packaging: Bulk; Plating: Tin; REACH SVHC: Yes; Terminal Pitch: 2.54mm; Termination: Solder; Voltage Rating (DC): 250V; ComponentLink1URL: https://datasheet.octopart.com:443/0022284200-Molex-datasheet-180714220.pdf?src-supplier=IHS; ComponentLink1Description: https://datasheet.octopart.com:443/0022284200-Molex-datasheet-180714220.pdf?src-supplier=IHS; ComponentLink2URL: https://datasheet.octopart.com:443/22-28-4200-Molex-datasheet-177722861.pdf?src-supplier=IHS; ComponentLink2Description: https://datasheet.octopart.com:443/22-28-4200-Molex-datasheet-177722861.pdf?src-supplier=IHS; ComponentLink3URL: https://datasheet.octopart.com:443/22-28-4200-Molex-datasheet-16300760.pdf?src-supplier=Molex; ComponentLink3Description: https://datasheet.octopart.com:443/22-28-4200-Molex-datasheet-16300760.pdf?src-supplier=Molex; ComponentLink4URL: https://sigma.octopart.com:443/16300370/technical_drawing/Molex-22-28-4200.pdf?src-supplier=Molex; ComponentLink4Description: https://sigma.octopart.com:443/16300370/technical_drawing/Molex-22-28-4200.pdf?src-supplier=Molex; ComponentLink5URL: https://datasheet.octopart.com:443/022284200-Molex-datasheet-8337137.pdf?src-supplier=Molex; ComponentLink5Description: https://datasheet.octopart.com:443/022284200-Molex-datasheet-8337137.pdf?src-supplier=Molex; ComponentLink6URL: https://datasheet.octopart.com:443/22-28-4200-Molex-datasheet-140181280.pdf?src-supplier=RS+(Formerly+Allied+Electronics); ComponentLink6Description: https://datasheet.octopart.com:443/22-28-4200-Molex-datasheet-140181280.pdf?src-supplier=RS+(Formerly+Allied+Electronics); ComponentLink7URL: https://datasheet.octopart.com:443/22-28-4200-Molex-datasheet-120146339.pdf?src-supplier=RS+(Formerly+Allied+Electronics); ComponentLink7Description: https://datasheet.octopart.com:443/22-28-4200-Molex-datasheet-120146339.pdf?src-supplier=RS+(Formerly+Allied+Electronics); ComponentLink8URL: https://datasheet.octopart.com:443/22-28-4200-Molex-datasheet-4210.pdf?src-supplier=DigiKey; ComponentLink8Description: https://datasheet.octopart.com:443/22-28-4200-Molex-datasheet-4210.pdf?src-supplier=DigiKey; ComponentLink9URL: http://sigma.octopart.com:80/16300761/rohs_statement/Molex-22-28-4200.pdf?src-supplier=Compliance+Statements; ComponentLink9Description: http://sigma.octopart.com:80/16300761/rohs_statement/Molex-22-28-4200.pdf?src-supplier=Compliance+Statements; ComponentLink10URL: http://sigma.octopart.com:80/conflict_mineral_statement/Molex-company-72.pdf?src-supplier=Compliance+Statements; ComponentLink10Description: http://sigma.octopart.com:80/conflict_mineral_statement/Molex-company-72.pdf?src-supplier=Compliance+Statements; ComponentLink11URL: http://sigma.octopart.com:80/rohs_statement/Molex-company-73.pdf?src-supplier=Compliance+Statements; ComponentLink11Description: http://sigma.octopart.com:80/rohs_statement/Molex-company-73.pdf?src-supplier=Compliance+Statements; ComponentLink12URL: http://sigma.octopart.com:80/reach_statement/Molex-company-74.pdf?src-supplier=Compliance+Statements; ComponentLink12Description: http://sigma.octopart.com:80/reach_statement/Molex-company-74.pdf?src-supplier=Compliance+Statements
P4 = 22-05-2041: KK 254 Wire-to-Board Header Single Row 90° 4 Circuits PA Polyamide Nylon Tin Plating; Manufacturer: Molex; Manufacturer Lifecycle Status: ACTIVE; Approvals: CSA, UL; Contact Resistance: 10mΩ; Current Rating: 4A; Gender: Male; Glow Wire Compliant: Non-compliant; Hole Diameter: 1.02mm; Insulation Resistance: 1GΩ; Max Voltage Rating (AC): 250V; Number of Circuits: 3; Number of Contacts: 4; Operating Force: 1.946N; Pitch: 2.54mm; Plating Thickness: 1.524µm; Supplier: DigiKey; Supplier Part Number: WM4102-ND; Manufacturer Part Number: 22-05-2041; RoHS: Compliant; Category: Headers and Wire Housings; Stock: 29591; Pricing: 1=0,27, 10=0,225, 100=0,1915, 500=0,1709, 1000=0,16274, 5000=0,14526, 10000=0,13833 (USD); China RoHS: Compliant; Color: White; Contact Gender: Male; Contact Material: Brass; Contact Plating: Tin; Country of Origin: US; Dielectric Material: Polyamide; Flammability Rating: UL94 V-0; Halogen Free: Low Halogen; Height: 6.3mm; Housing Color: White; Housing Material: Nylon; Lead Free: Lead Free; Lead Pitch: 2.54mm; Length: 14.99mm; Lifecycle Status: Production; Material: Nylon; Max Current Rating: 4A; Max Operating Temperature: 80°C; Min Operating Temperature: -40°C; Mounting Technology: Through Hole; Pins: 4; Number of Poles: 4; Number of Positions: 4; Number of Rows: 1; Orientation: Right Angle; Packaging: Bulk; Plating: Tin; Radiation Hardening: No; REACH SVHC: Yes; Schedule B: 8536694040, 8536694040|8536694040|8536694040|8536694040|8536694040; Terminal Pitch: 2.54mm; Termination: Solder; Voltage Rating: 250V; Voltage Rating (AC): 250V; Voltage Rating (DC): 250V; Working Voltage: 250V; ComponentLink1URL: https://datasheet.octopart.com:443/22-05-2041-Molex-datasheet-147626231.pdf?src-supplier=IHS; ComponentLink1Description: https://datasheet.octopart.com:443/22-05-2041-Molex-datasheet-147626231.pdf?src-supplier=IHS; ComponentLink2URL: https://datasheet.octopart.com:443/22-05-2041-Molex-datasheet-13784463.pdf?src-supplier=Molex; ComponentLink2Description: https://datasheet.octopart.com:443/22-05-2041-Molex-datasheet-13784463.pdf?src-supplier=Molex; ComponentLink3URL: https://datasheet.octopart.com:443/22-05-2041-Molex-datasheet-10979761.pdf?src-supplier=Molex; ComponentLink3Description: https://datasheet.octopart.com:443/22-05-2041-Molex-datasheet-10979761.pdf?src-supplier=Molex; ComponentLink4URL: https://datasheet.octopart.com:443/022052041-Molex-datasheet-8333278.pdf?src-supplier=element14; ComponentLink4Description: https://datasheet.octopart.com:443/022052041-Molex-datasheet-8333278.pdf?src-supplier=element14; ComponentLink5URL: https://datasheet.octopart.com:443/22-05-2041-Molex-datasheet-154746857.pdf?src-supplier=Master+Electronics; ComponentLink5Description: https://datasheet.octopart.com:443/22-05-2041-Molex-datasheet-154746857.pdf?src-supplier=Master+Electronics; ComponentLink6URL: https://datasheet.octopart.com:443/22-05-2041-Molex-datasheet-140180740.pdf?src-supplier=RS+(Formerly+Allied+Electronics); ComponentLink6Description: https://datasheet.octopart.com:443/22-05-2041-Molex-datasheet-140180740.pdf?src-supplier=RS+(Formerly+Allied+Electronics); ComponentLink7URL: https://datasheet.octopart.com:443/22-05-2041-Molex-datasheet-120144870.pdf?src-supplier=RS+(Formerly+Allied+Electronics); ComponentLink7Description: https://datasheet.octopart.com:443/22-05-2041-Molex-datasheet-120144870.pdf?src-supplier=RS+(Formerly+Allied+Electronics); ComponentLink8URL: https://datasheet.octopart.com:443/22-05-2041-Molex-datasheet-34442164.pdf?src-supplier=RS+(Formerly+Allied+Electronics); ComponentLink8Description: https://datasheet.octopart.com:443/22-05-2041-Molex-datasheet-34442164.pdf?src-supplier=RS+(Formerly+Allied+Electronics); ComponentLink9URL: https://datasheet.octopart.com:443/22-05-2041-Molex-datasheet-9709106.pdf?src-supplier=RS+(Formerly+Allied+Electronics); ComponentLink9Description: https://datasheet.octopart.com:443/22-05-2041-Molex-datasheet-9709106.pdf?src-supplier=RS+(Formerly+Allied+Electronics); ComponentLink10URL: https://datasheet.octopart.com:443/22-05-2041-Molex-datasheet-77519686.pdf?src-supplier=Newark; ComponentLink10Description: https://datasheet.octopart.com:443/22-05-2041-Molex-datasheet-77519686.pdf?src-supplier=Newark; ComponentLink11URL: https://datasheet.octopart.com:443/22-05-2041-Molex-datasheet-62061355.pdf?src-supplier=Electro+Sonic; ComponentLink11Description: https://datasheet.octopart.com:443/22-05-2041-Molex-datasheet-62061355.pdf?src-supplier=Electro+Sonic; ComponentLink12URL: https://datasheet.octopart.com:443/22-05-2041-Molex-datasheet-37168651.pdf?src-supplier=Electro+Sonic; ComponentLink12Description: https://datasheet.octopart.com:443/22-05-2041-Molex-datasheet-37168651.pdf?src-supplier=Electro+Sonic; ComponentLink13URL: https://datasheet.octopart.com:443/22-05-2041-Molex-datasheet-23708887.pdf?src-supplier=Electro+Sonic; ComponentLink13Description: https://datasheet.octopart.com:443/22-05-2041-Molex-datasheet-23708887.pdf?src-supplier=Electro+Sonic; ComponentLink14URL: https://datasheet.octopart.com:443/0022052041-Molex-datasheet-11867047.pdf?src-supplier=Arrow+Electronics; ComponentLink14Description: https://datasheet.octopart.com:443/0022052041-Molex-datasheet-11867047.pdf?src-supplier=Arrow+Electronics; ComponentLink15URL: https://datasheet.octopart.com:443/22-05-2041-Molex-datasheet-125897.pdf?src-supplier=DigiKey; ComponentLink15Description: https://datasheet.octopart.com:443/22-05-2041-Molex-datasheet-125897.pdf?src-supplier=DigiKey; ComponentLink16URL: https://datasheet.octopart.com:443/22-05-2041-Molex-datasheet-7572988.pdf?src-supplier=Jameco; ComponentLink16Description: https://datasheet.octopart.com:443/22-05-2041-Molex-datasheet-7572988.pdf?src-supplier=Jameco; ComponentLink17URL: https://datasheet.octopart.com:443/22-05-2041-Molex-datasheet-528327.pdf?src-supplier=Farnell; ComponentLink17Description: https://datasheet.octopart.com:443/22-05-2041-Molex-datasheet-528327.pdf?src-supplier=Farnell; ComponentLink18URL: http://sigma.octopart.com:80/16295454/rohs_statement/Molex-22-05-2041.pdf?src-supplier=Compliance+Statements; ComponentLink18Description: http://sigma.octopart.com:80/16295454/rohs_statement/Molex-22-05-2041.pdf?src-supplier=Compliance+Statements; ComponentLink19URL: http://sigma.octopart.com:80/reach_statement/Molex-company-74.pdf?src-supplier=Compliance+Statements; ComponentLink19Description: http://sigma.octopart.com:80/reach_statement/Molex-company-74.pdf?src-supplier=Compliance+Statements; ComponentLink20URL: http://sigma.octopart.com:80/rohs_statement/Molex-company-73.pdf?src-supplier=Compliance+Statements; ComponentLink20Description: http://sigma.octopart.com:80/rohs_statement/Molex-company-73.pdf?src-supplier=Compliance+Statements; ComponentLink21URL: http://sigma.octopart.com:80/conflict_mineral_statement/Molex-company-72.pdf?src-supplier=Compliance+Statements; ComponentLink21Description: http://sigma.octopart.com:80/conflict_mineral_statement/Molex-company-72.pdf?src-supplier=Compliance+Statements